# EAGLE board nRF9160 Thing Plus (EAGLE 9.6.2)
REV: C
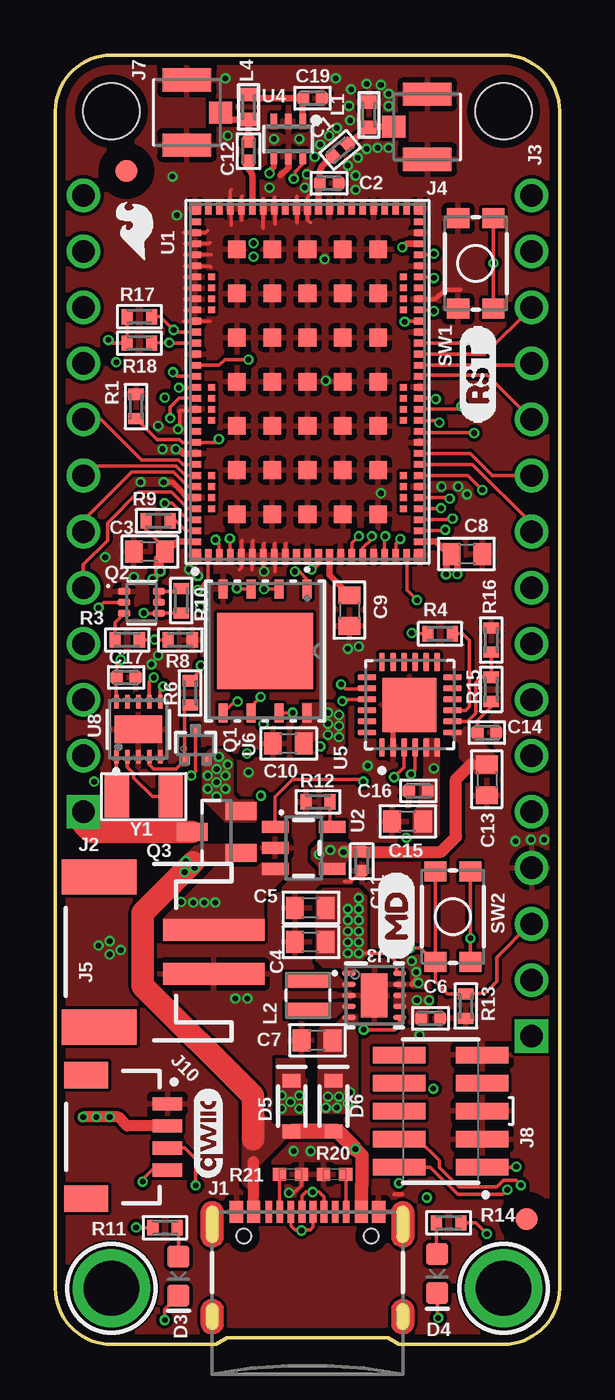
[diagram p3: board, top side]
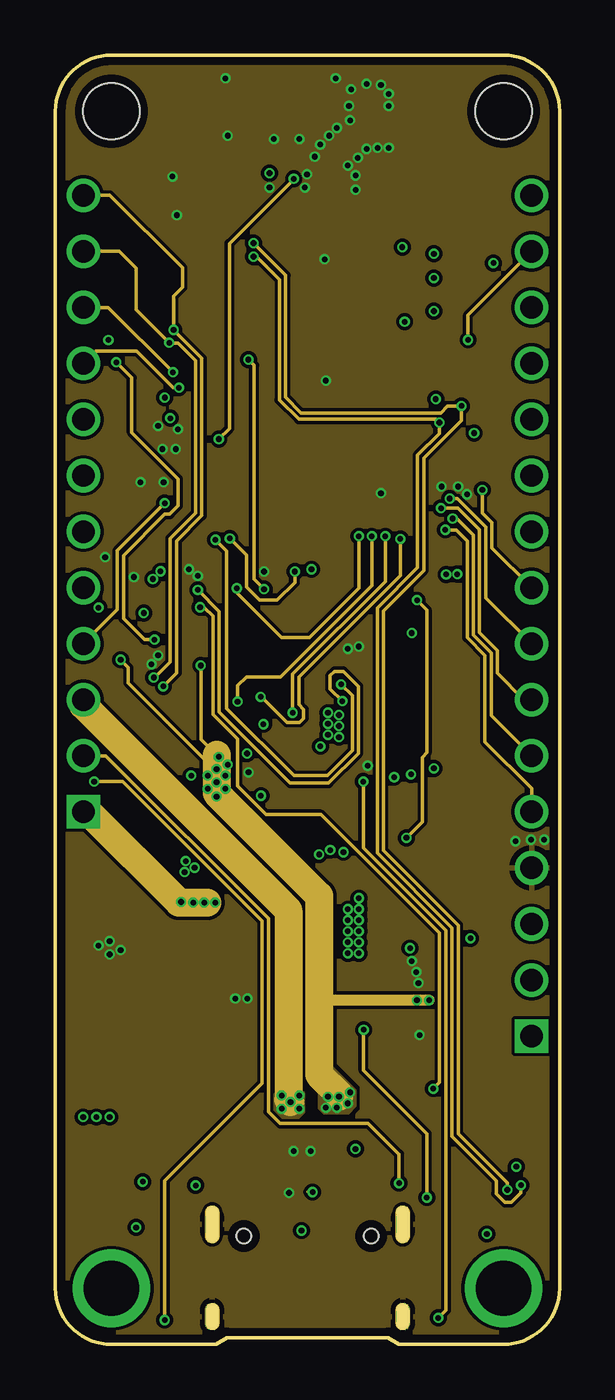
[diagram p4: board, inner layer Route2]
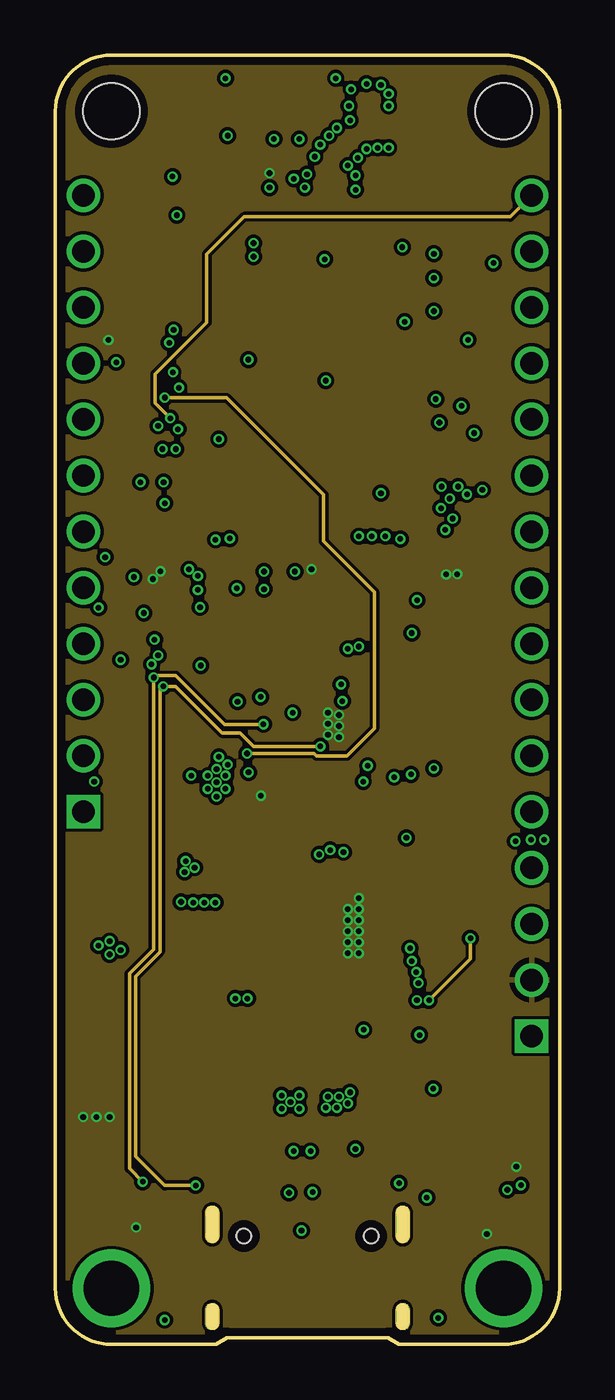
[diagram p5: board, inner layer Route15]
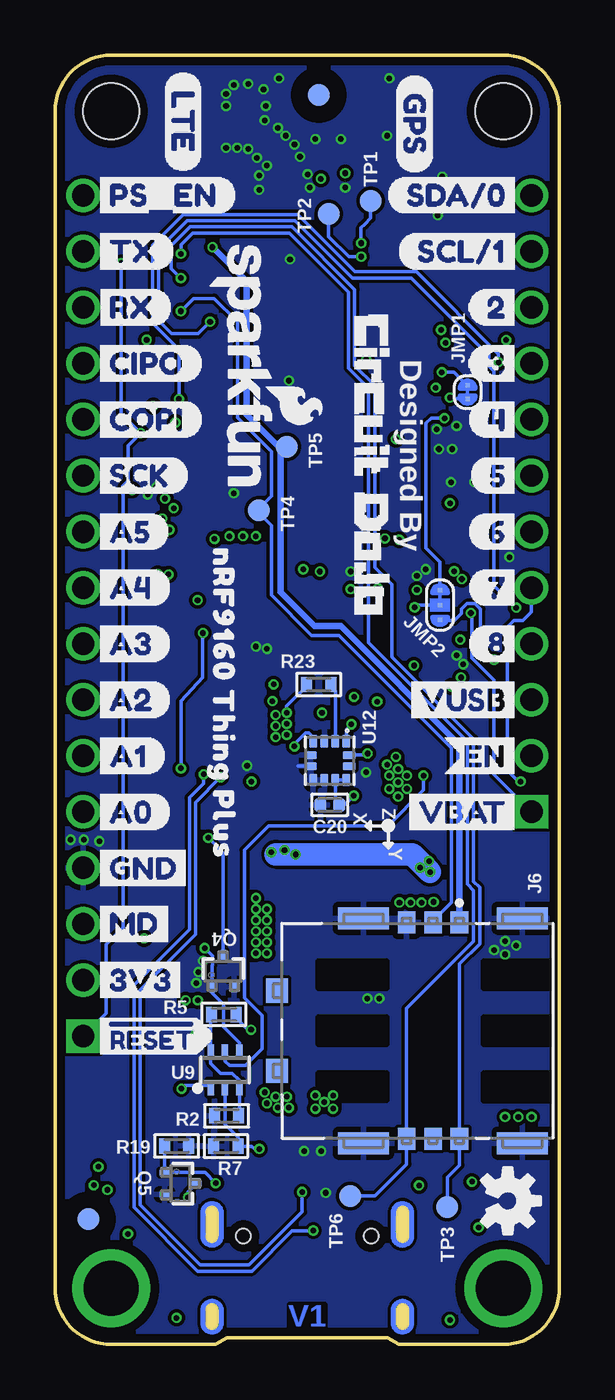
[diagram p6: board, bottom side, seen from below]

Size 22.86 x 58.42 mm. Coordinates in mm from the lower left corner, seen from the top.
Outline: 22.86,2.54 22.86,55.88 arc90 20.32,58.42 2.54,58.42 arc90 0,55.88 0,2.54 arc90 2.54,0 7.28,0 7.79,0.3 15.07,0.3 15.58,0 20.32,0 arc90 22.86,2.54
Copper layers (1*2*15*16): Top 0.035559375mm / dielectric 0.17018125mm / Route2 0.01778125mm / dielectric 47mil / Route15 0.01778125mm / dielectric 0.17018125mm / Bottom 0.035559375mm
Design rules "oshpark-4layer *": minimum track width 5mil, minimum drill 10mil, track to track 5mil, track to pad 5mil, pad to pad 5mil, via to via 5mil, smd to smd 5mil, copper to edge 15mil, drill to drill 6mil, minimum pad ring 4mil, minimum via ring 4mil, stop-mask expansion 2mil, vias tented up to drill 0.3mm, thermal gap 10mil
Net classes: 1 usb: width 0.15 mm; 2 rf: width 0.3 mm
Holes 2.54 mm at 2.54,55.88 20.32,55.88
tRestrict: area 17.4,28.6 to 17.6,29.4; area 15.7,27.5 to 16.5,27.7

## Footprints (pad centres in the part's own frame; a part is rotated, then mirrored left to right if it is on the bottom)
CAPC1005X55N = smd 0.54 x 0.6: 1 -0.43,0; 2 0.43,0
C0603 = smd 0.8 x 1: 1 -0.7,0; 2 0.7,0
LED-0603 = smd 1 x 1: A -0.877,0; C 0.877,0
SOD-323 = smd 0.63 x 0.83: A 1.15,0; C -1.15,0
USB-C-16P_4LAYER-PADS = smd 0.3 x 1: A5 -1.25,-0.34; A6 -0.25,-0.34; A7 0.25,-0.34; A8 1.25,-0.34; B5 1.75,-0.34; B6 0.75,-0.34; B7 -0.75,-0.34; B8 -1.75,-0.34 | smd 0.6 x 1: GND -3.225,-0.34; GND2 3.225,-0.34; VBUS1 -2.45,-0.34; VBUS2 2.45,-0.34 | drill 0.4 pad 0.6 long: SHLD1 -4.318,-0.915; SHLD2 4.318,-0.915; SHLD3 -4.318,-5.095; SHLD4 4.318,-5.095 | hole 0.65: -2.89,-1.445; 2.89,-1.445
CON-HEADER-1X12-MALE-PIN = drill 1.016 square: 1 0,0 | drill 1.016: 2 2.54,0; 3 5.08,0; 4 7.62,0; 5 10.16,0; 6 12.7,0; 7 15.24,0; 8 17.78,0; 9 20.32,0; 10 22.86,0; 11 25.4,0; 12 27.94,0
CON-HEADER-1X16-MALE-PIN = drill 1.016 square: 1 0,0 | drill 1.016: 2 2.54,0; 3 5.08,0; 4 7.62,0; 5 10.16,0; 6 12.7,0; 7 15.24,0; 8 17.78,0; 9 20.32,0; 10 22.86,0; 11 25.4,0; 12 27.94,0; 13 30.48,0; 14 33.02,0; 15 35.56,0; 16 38.1,0
TE_1909763-1 = smd 1 x 1.05: 1 0,-1.525 | smd 1.05 x 2.2: 2 -1.475,0; 3 1.475,0
JST-2-SMD = smd 1 x 4.6: 1 -1,-3.7; 2 1,-3.7 | smd 1.6 x 3.4: NC1 -3.4,1.5; NC2 3.4,1.5
MOLEX_104224-0820 = smd 1 x 2.3: G1 -5.1,1.5; G2 -5.1,8.7; G3 5.1,8.7; G4 5.1,1.5 | smd 1.1 x 1: R1 -1.82,12.625; R2 1.82,12.625 | smd 1 x 0.8: S1 4.9,4.35; S2 4.9,5.55; S3 -4.9,4.35; S4 4.9,6.75; S5 -4.9,5.55; S6 -4.9,6.75
SAMTEC_FTSH-105-XX-X-DV = smd 0.74 x 2.38: 1 -2.54,-1.88; 2 -2.54,1.88; 3 -1.27,-1.88; 4 -1.27,1.88; 5 0,-1.88; 6 0,1.88; 7 1.27,-1.88; 8 1.27,1.88; 9 2.54,-1.88; 10 2.54,1.88
JST04_1MM_RA = smd 0.6 x 1.35: 1 -1.5,0; 2 -0.5,0; 3 0.5,0; 4 1.5,0 | smd 1.2 x 2: NC1 2.8,-3.675; NC2 -2.8,-3.675
JUMPER-ROUND-NC = smd 0.2 x 0.2: P$1 -0.3,0; P$2 0.3,0
JUMPER-ROUND-3-NO-R = smd 0.2 x 0.2: P$1 -0.675,0; P$2 0,0; P$3 0.675,0
IND0402_22N_TAI = smd 0.61 x 0.711: 1 -0.572,0; 2 0.572,0
IND-2P0X2P0X1P2 = smd 0.65 x 2: P$1 -0.675,0; P$2 0.675,0
DIO_RB558WMF-L = smd 0.254 x 0.483: 1 -0.5,-0.711; 2 0.5,-0.711; 3 0,0.711
SOT50P160X60-6N = smd 0.56 x 0.32: 1 -0.785,0.5; 2 -0.785,0; 3 -0.785,-0.5; 4 0.785,-0.5; 5 0.785,0; 6 0.785,0.5
SOT23 = smd 0.8 x 1.4: 1 -0.95,-1.1; 2 0.95,-1.1; 3 0,1.1
R0402-M = smd 0.5 x 0.7: 1 -0.55,0; 2 0.55,0
0402-TIGHT = smd 0.6 x 0.6: 1 -0.5,0; 2 0.5,0
TACTILE_SWITCH_SMD_4.6X2.8MM = smd 0.9 x 1: 1 -2.05,-0.8; 2 2.05,-0.8; 3 2.05,0.8; 4 -2.05,0.8
TP-1P0 = smd 1 x 1: TP 0,0
NORDIC_NRF9160-SICA-R = smd 0.54 x 0.54: 1 -7.845,5.095; 21 -7.845,-5.095; 52 7.845,-5.095; 72 7.845,5.095 | smd 0.54 x 0.3: 2 -7.845,4.5; 3 -7.845,4; 4 -7.845,3.5; 5 -7.845,3; 6 -7.845,2.5; 7 -7.845,2; 8 -7.845,1.5; 9 -7.845,1; 10 -7.845,0.5; 11 -7.845,0; 12 -7.845,-0.5; 13 -7.845,-1; 14 -7.845,-1.5; 15 -7.845,-2; 16 -7.845,-2.5; 17 -7.845,-3; 18 -7.845,-3.5; 19 -7.845,-4; 20 -7.845,-4.5; 53 7.845,-4.5; 54 7.845,-4; 55 7.845,-3.5; 56 7.845,-3; 57 7.845,-2.5; 58 7.845,-2; 59 7.845,-1.5; 60 7.845,-1; 61 7.845,-0.5; 62 7.845,0; 63 7.845,0.5; 64 7.845,1; 65 7.845,1.5; 66 7.845,2; 67 7.845,2.5; 68 7.845,3; 69 7.845,3.5; 70 7.845,4; 71 7.845,4.5 | smd 0.3 x 0.54: 22 -7.25,-5.095; 23 -6.75,-5.095; 24 -6.25,-5.095; 25 -5.75,-5.095; 26 -5.25,-5.095; 27 -4.75,-5.095; 28 -4.25,-5.095; 29 -3.75,-5.095; 30 -3.25,-5.095; 31 -2.75,-5.095; 32 -2.25,-5.095; 33 -1.75,-5.095; 34 -1.25,-5.095; 35 -0.75,-5.095; 36 -0.25,-5.095; 37 0.25,-5.095; 38 0.75,-5.095; 39 1.25,-5.095; 40 1.75,-5.095; 41 2.25,-5.095; 42 2.75,-5.095; 43 3.25,-5.095; 44 3.75,-5.095; 45 4.25,-5.095; 46 4.75,-5.095; 47 5.25,-5.095; 48 5.75,-5.095; 49 6.25,-5.095; 50 6.75,-5.095; 51 7.25,-5.095; 73 7.25,5.095; 74 6.75,5.095; 75 6.25,5.095; 76 5.75,5.095; 77 5.25,5.095; 78 4.75,5.095; 79 4.25,5.095; 80 3.75,5.095; 81 3.25,5.095; 82 2.75,5.095; 83 2.25,5.095; 84 1.75,5.095; 85 1.25,5.095; 86 0.75,5.095; 87 0.25,5.095; 88 -0.25,5.095; 89 -0.75,5.095; 90 -1.25,5.095; 91 -1.75,5.095; 92 -2.25,5.095; 93 -2.75,5.095; 94 -3.25,5.095; 95 -3.75,5.095; 96 -4.25,5.095; 97 -4.75,5.095; 98 -5.25,5.095; 99 -5.75,5.095; 100 -6.25,5.095; 101 -6.75,5.095; 102 -7.25,5.095 | smd 0.8 x 0.8: 103_1 -6,3.2; 103_2 -4,3.2; 103_3 -2,3.2; 103_4 0,3.2; 103_5 2,3.2; 103_6 4,3.2; 103_7 6,3.2; 103_8 -6,1.6; 103_9 -4,1.6; 103_10 -2,1.6; 103_11 0,1.6; 103_12 2,1.6; 103_13 4,1.6; 103_14 6,1.6; 103_15 -6,0; 103_16 -4,0; 103_17 -2,0; 103_18 0,0; 103_19 2,0; 103_20 4,0; 103_21 6,0; 103_22 -6,-1.6; 103_23 -4,-1.6; 103_24 -2,-1.6; 103_25 0,-1.6; 103_26 2,-1.6; 103_27 4,-1.6; 103_28 6,-1.6; 103_29 -6,-3.2; 103_30 -4,-3.2; 103_31 -2,-3.2; 103_32 0,-3.2; 103_33 2,-3.2; 103_34 4,-3.2; 103_35 6,-3.2 | smd 0.3 x 0.3: 104 -5.75,-4.35; 105 -5.25,-4.35; 106 -4.75,-4.35; 107 -4.25,-4.35; 108 -1.75,-4.35; 109 -1.25,-4.35; 110 -0.75,-4.35; 111 -0.25,-4.35; 112 3.25,-4.35; 113 3.75,-4.35; 114 4.25,-4.35; 115 4.75,-4.35; 116 4.75,4.35; 117 4.25,4.35; 118 3.75,4.35; 119 3.25,4.35; 120 -0.25,4.35; 121 -0.75,4.35; 122 -1.25,4.35; 123 -1.75,4.35; 124 -4.25,4.35; 125 -4.75,4.35; 126 -5.25,4.35; 127 -5.75,4.35
SOT23-5 = smd 0.55 x 1.2: 1 -0.95,-1.3; 2 0,-1.3; 3 0.95,-1.3; 4 0.95,1.3; 5 -0.95,1.3
DSK0010A = smd 0.6 x 0.25: 1 -1.15,1; 2 -1.15,0.5; 3 -1.15,0; 4 -1.15,-0.5; 5 -1.15,-1; 6 1.15,-1; 7 1.15,-0.5; 8 1.15,0; 9 1.15,0.5; 10 1.15,1 | smd 1.2 x 2: 11 0,0
SOT363 = smd 0.3 x 0.7: 1 -0.65,-0.8; 2 0,-0.8; 3 0.65,-0.8; 4 0.65,0.8; 5 0,0.8; 6 -0.65,0.8
QFN50P400X400X80-25N = smd 0.84 x 0.26: 1 -1.935,1.25; 2 -1.935,0.75; 3 -1.935,0.25; 4 -1.935,-0.25; 5 -1.935,-0.75; 6 -1.935,-1.25; 13 1.935,-1.25; 14 1.935,-0.75; 15 1.935,-0.25; 16 1.935,0.25; 17 1.935,0.75; 18 1.935,1.25 | smd 0.26 x 0.84: 7 -1.25,-1.935; 8 -0.75,-1.935; 9 -0.25,-1.935; 10 0.25,-1.935; 11 0.75,-1.935; 12 1.25,-1.935; 19 1.25,1.935; 20 0.75,1.935; 21 0.25,1.935; 22 -0.25,1.935; 23 -0.75,1.935; 24 -1.25,1.935 | smd 2.45 x 2.45: 25 0,0
WIN_ZP-8-L = smd 0.86 x 0.403: 1 -2.818,1.905; 2 -2.818,0.635; 3 -2.818,-0.635; 4 -2.818,-1.905; 5 2.818,-1.905; 6 2.818,-0.635; 7 2.818,0.635; 8 2.818,1.905 | smd 3.454 x 4.343: 9 0,0
DFN10_2P7X2P7-L = smd 0.61 x 0.203: 1 -1.245,1; 2 -1.245,0.5; 3 -1.245,0; 4 -1.245,-0.5; 5 -1.245,-1; 6 1.245,-1; 7 1.245,-0.5; 8 1.245,0; 9 1.245,0.5; 10 1.245,1 | smd 1.245 x 2.159: 11 0,0
PQFN50P200X200100-12N = smd 0.575 x 0.35: 1 -0.875,0.75; 2 -0.875,0.25; 3 -0.875,-0.25; 4 -0.875,-0.75; 7 0.875,-0.75; 8 0.875,-0.25; 9 0.875,0.25; 10 0.875,0.75 | smd 0.35 x 0.575: 5 -0.25,-0.875; 6 0.25,-0.875; 11 0.25,0.875; 12 -0.25,0.875
FIDUCIAL-1MM = smd 1 x 1: 1 0,0
MOUNTING-HOLE-2.5MM-PLATED = drill 2.5 pad 3.2: P$1 0,0
XTAL320X150X90 = smd 1.092 x 1.905: 1 -1.219,0; 2 1.219,0

## Placement (x,y rotation side)
C1  15p  [CAPC1005X55N]  12.91,54.12 220 top
C2  15p  [CAPC1005X55N]  12.41,52.62 0 top
C3  4.7u  [C0603]  4.26,35.92 180 top
C4  10u  [C0603]  11.56,18.23 180 top
C5  10u  [C0603]  11.56,19.78 180 top
C6  0.1u  [CAPC1005X55N]  17.01,14.77 0 top
C7  10u  [C0603]  11.86,13.78 180 top
C8  4.7u  [C0603]  18.66,35.82 0 top
C9  4.7u  [C0603]  13.33,33.25 270 top
C10  4.7u  [C0603]  10.56,27.22 180 top
C11  1u  [CAPC1005X55N]  13.89,21.89 270 top
C12  56p  [CAPC1005X55N]  8.76,54.07 90 top
C13  4.7u  [C0603]  19.56,25.58 270 top
C14  0.1u  [CAPC1005X55N]  19.56,27.72 0 top
C15  4.7u  [C0603]  15.96,23.7 180 top
C16  0.1u  [CAPC1005X55N]  16.46,25.08 180 top
C17  0.1u  [CAPC1005X55N]  3.21,30.22 0 top
C19  56p  [CAPC1005X55N]  11.66,56.47 0 top
C20  0.1u  [CAPC1005X55N]  10.41,24.45 180 bottom
D3  BLUE  [LED-0603]  5.58,3.1 270 top
D4  Yellow  [LED-0603]  17.31,3.2 270 top
D5  1A/23V/620mV  [SOD-323]  10.71,10.8 270 top
D6  1A/23V/620mV  [SOD-323]  12.61,10.8 270 top
J1  USB Female C  [USB-C-16P_4LAYER-PADS]  11.43,6.35 0 top
J2  CON-HEADER-1X12-MALE-PIN  [CON-HEADER-1X12-MALE-PIN]  1.27,24.13 90 top
J3  CON-HEADER-1X16-MALE-PIN  [CON-HEADER-1X16-MALE-PIN]  21.59,13.97 90 top
J4  CON-1909763-1  [TE_1909763-1]  16.86,55.17 270 top
J5  [JST-2-SMD]  3.48,17.78 90 top
J6  CON-SIM-104224-0820  [MOLEX_104224-0820]  0.18,14.21 90 bottom
J7  CON-1909763-1  [TE_1909763-1]  5.96,55.82 90 top
J8  CON-FTSH-105-XX-X-DV  [SAMTEC_FTSH-105-XX-X-DV]  17.47,10.57 90 top
J10  QWIIC_RIGHT_ANGLE  [JST04_1MM_RA]  5.08,9.4 270 top
JMP1  JUMPER-NC  [JUMPER-ROUND-NC]  4.16,43.15 90 bottom
JMP2  JUMPER-3/1  [JUMPER-ROUND-3-NO-R]  5.41,33.5 90 bottom
L1  39n  [IND0402_22N_TAI]  14.21,55.72 270 top
L2  1.5u  [IND-2P0X2P0X1P2]  11.46,15.82 90 top
L4  68n  [IND0402_22N_TAI]  8.76,56.07 270 top
LOGO5  OSHW-LOGOS  [OSHW-LOGO-S]  2.35,6.5 270 bottom
PCB1  PCB-NRF91-FEATHER  [PLACEHOLDER]  -12.93,-5.08 0 top  (outside the outline)
Q1  MOSFET-P-SC89  [DIO_RB558WMF-L]  6.36,27.17 0 top
Q2  MOSFET-DUAL-COMP-SOT563  [SOT50P160X60-6N]  3.91,33.62 0 top
Q3  MOSFET-P-20V-4.7A-SOT23  [SOT23]  7.31,23.22 90 top
Q4  MOSFET-N-SC89  [DIO_RB558WMF-L]  15.24,16.91 0 bottom
Q5  MOSFET-N-SC89  [DIO_RB558WMF-L]  17.18,7.29 270 bottom
R1  100k  [R0402-M]  3.66,42.5 270 top
R2  1M  [R0402-M]  15.09,10.36 0 bottom
R3  100k  [R0402-M]  3.26,31.92 180 top
R4  1k  [R0402-M]  17.44,32.2 180 top
R5  100k  [R0402-M]  15.21,14.95 180 bottom
R6  100k  [R0402-M]  6.11,29.52 90 top
R7  100k  [R0402-M]  15.12,8.98 0 bottom
R8  100k  [R0402-M]  5.66,31.92 180 top
R9  1M  [R0402-M]  4.66,37.32 180 top
R10  100k  [R0402-M]  5.71,33.7 270 top
R11  330  [R0402-M]  4.97,5.28 180 top
R12  2k  [R0402-M]  11.91,24.58 0 top
R13  100k  [R0402-M]  18.61,15.33 90 top
R14  330  [R0402-M]  17.83,5.51 0 top
R15  22k  [R0402-M]  19.76,29.68 270 top
R16  33k  [R0402-M]  19.76,31.92 270 top
R17  10k  [R0402-M]  3.81,46.57 180 top
R18  10k  [R0402-M]  3.81,45.37 180 top
R19  1M  [R0402-M]  17.36,8.99 180 bottom
R20  5.1k  [0402-TIGHT]  12.66,7.7 0 top
R21  5.1k  [0402-TIGHT]  10.66,7.7 180 top
R23  100k  [R0402-M]  10.91,29.9 180 bottom
SW1  [TACTILE_SWITCH_SMD_4.6X2.8MM]  19.06,48.98 90 top
SW2  [TACTILE_SWITCH_SMD_4.6X2.8MM]  18.02,19.38 90 top
TP1  TP-1SIDE-1P0  [TP-1P0]  8.56,51.82 270 bottom
TP2  TP-1SIDE-1P0  [TP-1P0]  10.46,51.22 270 bottom
TP3  TP-1SIDE-1P0  [TP-1P0]  5.08,6.23 270 bottom
TP4  TP-1SIDE-1P0  [TP-1P0]  13.62,37.8 270 bottom
TP5  TP-1SIDE-1P0  [TP-1P0]  12.36,40.67 270 bottom
TP6  TP-1SIDE-1P0  [TP-1P0]  9.49,6.72 180 bottom
U1  MOD-NRF9160-SICA-R  [NORDIC_NRF9160-SICA-R]  11.43,43.62 90 top
U2  MCP73831  [SOT23-5]  11.26,22.5 270 top
U3  IC-TPS63031DSKR  [DSK0010A]  14.46,15.82 0 top
U4  POWER-SWITCH-MIC94092YC6  [SOT363]  10.56,54.62 180 top
U5  IC-CP2102N-A02-GQFN24R  [QFN50P400X400X80-25N]  16.06,28.98 90 top
U6  FLASH-WSON  [WIN_ZP-8-L]  9.51,31.42 270 top
U8  IC-PCF85063ATL/1  [DFN10_2P7X2P7-L]  3.76,27.87 90 top
U9  IC-BAV70S  [SOT363]  15.16,12.44 0 bottom
U12  IC-LIS2DH12TR  [PQFN50P200X200100-12N]  10.41,26.45 270 bottom
U$1  [SFE_LOGO_NAME_FLAME_.1]  14.42,44.27 270 bottom
U$2  [LOGO-CIRCUITDOJO]  9.67,46.9 270 bottom
U$3  FIDUCIAL-1MM  [FIDUCIAL-1MM]  10.91,56.62 270 bottom
U$4  FIDUCIAL-1MM  [FIDUCIAL-1MM]  21.36,5.67 270 bottom
U$5  [A3L-LOC]  -164.72,-120.13 0 top  (outside the outline)
U$6  [QWIIC_4MM]  6.94,9.57 90 top
U$7  [RST0]  19.16,41.7 90 top
U$8  [PS_EN0]  21.31,52.07 0 bottom
U$9  [MD0]  15.46,17.4 90 top
U$10  [20]  4.2,46.99 0 bottom
U$11  [30]  4.2,44.45 0 bottom
U$12  [SCL#11]  7.34,49.53 0 bottom
U$13  [SDA#00]  7.82,52.07 0 bottom
U$14  [MD0]  21.31,19.05 0 bottom
U$15  [SFE_LOGO_FLAME_.1]  3.71,50.65 45 top
U$16  [TX0]  21.31,49.53 0 bottom
U$17  [RX0]  21.31,46.99 0 bottom
U$18  [SCK0]  21.31,39.37 0 bottom
U$19  [CIPO0]  21.31,44.45 0 bottom
U$20  [COPI0]  21.31,41.91 0 bottom
U$21  [GPS0]  6.56,57.6 270 bottom
U$22  [LTE0]  17.06,57.7 270 bottom
U$23  [NRF9160_THING_PLUS0]  15.22,29.03 270 bottom
U$24  FIDUCIAL-1MM  [FIDUCIAL-1MM]  21.36,5.67 90 top
U$31  MOUNTING-HOLE-2.5MM-PLATED  [MOUNTING-HOLE-2.5MM-PLATED]  2.54,2.54 0 top
U$32  MOUNTING-HOLE-2.5MM-PLATED  [MOUNTING-HOLE-2.5MM-PLATED]  20.32,2.54 0 top
U$35  FIDUCIAL-1MM  [FIDUCIAL-1MM]  3.23,53.17 0 top
U$69  [GND12]  21.31,21.59 0 bottom
U$71  [3V314]  21.35,16.51 0 bottom
U$72  [#RESET15]  21.46,13.97 0 bottom
U$73  [VUSB25]  7.23,29.21 0 bottom
U$74  [EN26]  5.28,26.67 0 bottom
U$75  [VBAT27]  7.28,24.13 0 bottom
U$83  [A56]  21.31,36.83 0 bottom
U$84  [A47]  21.3,34.29 0 bottom
U$85  [A38]  21.34,31.75 0 bottom
U$86  [A29]  21.35,29.21 0 bottom
U$87  [A110]  21.3,26.67 0 bottom
U$88  [A011]  21.35,24.13 0 bottom
U$89  [412]  4.2,41.91 0 bottom
U$90  [513]  4.11,39.37 0 bottom
U$91  [614]  4.16,36.83 0 bottom
U$92  [715]  4.16,34.29 0 bottom
U$93  [816]  4.15,31.75 0 bottom
Y1  XTAL-ABS07AIG-32.768KHZ-7-T  [XTAL320X150X90]  4.01,24.82 180 top

## Tracks (layer width: path | path; a pad name or v marks a point on that pad's centre or on a via)
!EN  (via drill 0.25)
  Route2 0.152: J2.2 2.29,26.67 9.66,19.3 9.66,10.54 10.19,10.01 14.18,10.01 15.58,8.61 v15.58,7.3
  Bottom 0.152: R19.2 17.91,7.8 Q5.1 16.07,7.79 v15.58,7.3
!RESET  (via drill 0.25)
  Top 0.152: U1.32 16.48,41.32 18.96,41.32 v18.98,41.3 | SW1.1 v19.86,49 SW1.2
  Bottom 0.152: J3.1 20.55,15.01 20.55,18.13 19.78,18.9 19.78,38.53 19.79,38.54 19.79,38.9 19.55,39.14 19.55,40.73 v18.98,41.3 19.86,42.17 19.86,48.98 v19.86,48.99 v19.86,49
+3V3  (via drill 0.25)
  Top 0.152: C3.1 5.01,36.02 4.11,36.92 R9.2 | 4.27,5.43 R11.2 3.68,5.28 v3.66,5.3 | U1.12 11.93,35.34 11.71,35.12 v11.61,35.12 | R17.2 R18.2 2.55,45.37 v2.41,45.51 | R14.2 19.05,5.51 v19.56,5 | U3.10 15.46,16.97 15.46,17.3 15.04,17.72 v13.76,17.72 | J8.1 20.88,8.03 v20.9,8.05
  Top 0.203: C8.1 17.79,35.84
  Top 0.254: v9.71,53.07 9.71,53.17 9.91,53.37 U4.4
  Top 0.305: U1.102 5.56,36.37 C3.1 4.77,35.41 v4.77,35.03 | v4.42,34.68 4.61,34.87 4.61,35.62 5.01,36.02 | v17.72,34.89 17.72,35.58 C8.1 18.22,35.56 v18.22,34.9 | U1.22 17.26,36.37 17.79,35.84
  Top 0.508: J10.2 3.26,9.9 2.86,10.3 v2.46,10.3 v1.86,10.3 v1.26,10.3
  Bottom 0.152: U12.10 U12.9 10.16,24.63 C20.1 9.73,24.45 v9.32,24.86 | v12.36,28.62 12.36,28.92 11.46,29.82 R23.2
  other vias: 13.76,18.72 13.76,18.22 13.26,18.72 13.26,19.22 13.76,19.22 13.76,19.72 13.26,19.72 13.76,20.22 12.36,27.62 12.36,28.12 12.86,28.52 12.86,28.02 12.86,27.52 13.26,18.22 13.26,17.72
  pour Top (no thermals): 13.56,17.12 13.56,16.82 13.06,16.82 13.06,17.02 12.96,17.12 12.16,17.12 11.86,17.42 11.86,20.32 12.16,20.62 13.74,20.62 14.06,20.3 14.06,17.62
  pour Route15 (isolate 0.152, rank 2): 22.86,58.42 22.86,0 0,0 0,58.42
  pour Top (no thermals): 10.96,26.82 12.66,26.82 13.06,27.22 13.06,28.52 12.56,29.02 11.26,29.02 11.26,28.12 10.96,27.82
ANT
  Top 0.3: U1.61 11.93,52.57 C2.1 11.98,53.02 arc-49 12.2,53.5 arc3 C1.2
ANT_FILT
  Top 0.3: C1.1 14.11,55.05 L1.2 14.21,55.17 J4.1
CHRG  (via drill 0.25)
  Top 0.152: U2.1 9.96,24.8 10.76,25.6 13.86,25.6 v13.96,25.5 | v17.36,1.2 17.31,1.25 D4.C
  Route2 0.152: v13.96,25.5 13.96,22.5 17.71,18.75 17.71,1.55 v17.36,1.2 17.57,1.41
COEX0/LNA_EN  (via drill 0.25)
  Top 0.152: v7.41,41.02 7.41,40.87 U1.93 5.77,40.87 5.64,41 4.61,41 R1.2 | U4.6 11.21,53.47 10.86,53.12 10.86,52.82 v10.81,52.82
  Route2 0.152: v7.41,41.02 7.89,41.5 7.89,49.88 10.81,52.8 v10.81,52.82
CP212_VBUS
  Top 0.152: U5.8 18.69,28.23 19.06,28.6 19.06,30 19.29,30.23 R15.1 R16.2
CP2102N-!RST
  Top 0.152: R4.1 18.46,32.2 18.76,31.9 18.76,28.9 18.59,28.73 U5.9
CP2102N-VDD  (via drill 0.25)
  Top 0.152: R4.2 16.16,32.2 v16.16,32.23
  Bottom 0.152: v17.16,26.1 17.16,29.15 16.17,30.21 v16.17,32.22 v16.16,32.23
  pour Top (no thermals): 16.76,27.4 16.76,25.6 16.56,25.4 16.56,24.4 16.26,24.1 16.26,23.1 17.36,23.1 17.36,27.4
DIFF_N  (via drill 0.25)
  Top 0.152: J1.B7 10.68,5.38 10.86,5.2 11.16,5.2 | 11.16,5.2 11.56,5.2 11.68,5.32 J1.A7 | 11.16,5.2 v11.16,5.15 | U5.4 16.31,26.01 v16.12,25.83
  Bottom 0.152: v16.12,25.83 16.12,25.43 16.77,24.78 16.77,18.8 19.29,16.29 19.29,6.21 16.4,3.32 13.94,3.32 12.11,5.15 v11.16,5.15
DIFF_P  (via drill 0.25)
  Top 0.152: J1.A6 11.18,6.72 11.36,6.9 v11.66,6.9 11.96,6.9 12.18,6.68 J1.B6 | U5.3 15.81,26.15 v15.36,25.7
  Route2 0.152: v11.66,6.9 11.46,6.9
  Bottom 0.152: v15.36,25.7 16.5,24.57 16.5,18.59 19.01,16.07 19.01,6.33 16.28,3.6 14.06,3.6 11.66,6 v11.66,6.9
FLASH_CS  (via drill 0.25)
  Top 0.152: U1.4 7.93,36.5 v7.91,36.52 | v10.86,35.02 11.06,35.02 11.41,34.66 U6.1
  Route2 0.152: v7.91,36.52 8.66,35.77 8.66,34.32 9.26,33.72 10.06,33.72 10.86,34.52 v10.86,35.02
FLASH_HOLD  (via drill 0.25)
  Top 0.152: U1.18 14.93,36.59 v14.96,36.62 | U6.7 10.74,28.6 v10.76,28.62
  Route2 0.152: v14.96,36.62 14.96,34.57 10.76,30.37 v10.76,28.62
FLASH_SCK  (via drill 0.25)
  Top 0.152: v15.64,36.5 15.43,36.29 U1.19 | U6.6 8.88,28.9 v9.31,29.34
  Route2 0.152: v9.31,29.34 9.34,29.34 10.49,28.19 11.08,28.19 11.26,28.37 11.26,28.77 11.04,28.99 11.04,30.25 15.64,34.85 v15.64,36.5
FLASH_SI  (via drill 0.25)
  Top 0.152: U6.5 8.13,29.13 v8.26,29.13 | v14.34,36.62 14.34,36.49 13.93,36.08 U1.16
  Route2 0.152: v8.26,29.13 8.26,29.85 8.66,30.25 10.21,30.25 14.34,34.38 v14.34,36.62
FLASH_SO  (via drill 0.25)
  Top 0.152: U1.86 7.43,44.37 7.68,44.62 v8.76,44.62 | U6.2 9.48,34.24 v9.46,34.22
  Route2 0.152: v9.46,34.22 9.01,34.67 9.01,44.37 v8.76,44.62
FLASH_WP  (via drill 0.25)
  Top 0.152: U1.15 13.45,35.89 13.45,36.31 v13.76,36.62 | v8.23,34.26 8.25,34.24 U6.3
  Route2 0.152: v8.23,34.26 8.23,34.06 10.24,32.04 11.53,32.04 13.76,34.27 v13.76,36.62
GND  (via drill 0.25)
  Top 0.152: 5.81,46.37 U1.82 7.01,46.37 | 5.81,50.37 U1.74 6.81,50.37 6.91,50.47 | 6.48,46.87 5.86,46.87 | 6.48,47.37 5.86,47.37 | 6.48,47.87 5.86,47.87 | 6.48,48.37 U1.78 5.86,48.37 | 6.48,48.87 5.86,48.87 | 6.48,49.37 5.86,49.37 | 6.48,49.87 5.86,49.87 | 9.41,50.57 9.41,51.35 U1.66 9.41,51.39 9.41,51.92 | 9.96,50.77 9.96,51.34 U1.65 9.93,51.99 | 10.96,50.82 10.96,51.34 U1.63 10.93,51.99 10.96,52.02 | 11.56,50.82 11.43,50.95 U1.62 11.43,51.99 11.51,52.07 | U1.77 7.01,48.87 7.06,48.82 | U1.76 7.06,49.37 | U1.75 6.96,49.87 7.01,49.92 | U1.90 6.29,42.32 5.66,42.32 5.64,42.3 5.64,41.54 v5.57,41.47 v5.56,41.47 | 7.96,50.72 7.96,51.44 U1.69 7.93,52.29 7.96,52.32 | 8.46,52.02 8.43,51.99 U1.68 8.43,50.95 | 8.46,36.42 8.43,36.39 U1.5 8.43,35.19 8.36,35.12 | U1.6 8.93,36.39 8.96,36.42 | 9.46,36.32 9.43,36.29 U1.7 9.43,35.64 9.41,35.62 | 9.96,36.32 9.93,36.29 U1.8 9.96,35.74 9.96,35.02 | U1.9 10.43,36.29 10.46,36.32 | 8.91,35.72 8.91,35.12 | 9.41,35.72 9.41,35.62 | 9.41,35.62 9.41,35.12 | R21.1 11.16,7.2 10.83,6.87 v10.59,6.87 | C11.2 13.41,20.98 13.11,20.98
  Top 0.2: J1.GND2 15.66,6.01 15.75,5.92 J1.SHLD2 | 15.72,6.79 15.37,6.79
  Top 0.203: 16.06,28.7 U5.25 | 18.36,47.8 17.69,47.8 17.46,47.56 17.43,47.56 17.23,47.37 U1.44
  Top 0.254: 16.16,16.32 16.36,16.52 | 5.87,38.51 5.31,39.07 v4.91,39.07 | U5.2 15.31,27.95 16.06,28.7
  Top 0.3: 9.71,52.47 v9.71,52.42 | 10.22,52.98 10.56,53.32 U4.5
  Top 0.305: U1.98 6.01,38.37 5.87,38.51 | U1.94 5.8,40.37 5.69,40.48 5.55,40.48 v5.46,40.57
  Bottom 0.152: U12.6 11.86,26.2
  other vias: 3.86,39.07 2.26,35.67 3.56,34.77 6.46,34.82 6.06,35.12 8.16,15.67 8.71,15.67 17.51,38.87 18.26,38.87 18.66,38.52 13.26,53.42 13.61,52.97 13.71,53.77 15.11,56.12 5.31,52.92 5.51,51.17 15.11,54.22 14.11,54.17 4.86,40.57 4.66,41.62 9.91,54.62 11.06,54.62 13.61,52.32 15.11,56.67 13.31,56.12 13.41,56.87 14.11,57.12 14.76,57.07 13.36,55.47 12.76,55.12 12.41,54.77 12.01,54.37 11.76,53.82 11.41,53.02 11.31,52.42 12.71,57.37 14.61,54.22 7.71,57.37 7.81,54.77 9.46,35.02 14.76,38.57 21.56,22.87 20.86,22.8 22.16,22.87 2.46,18.27 1.96,18.07 2.96,17.87 2.46,17.67 16.46,16.37 16.36,16.87 16.16,17.37 16.51,14.02 12.26,43.67 12.21,49.17 4.66,31.22 4.36,30.82 13.26,31.52 13.76,31.62 8.76,25.92 14.16,26.22 10.8,8.76 11.57,8.76
  pour Top (isolate 0.152, rank 2): 0,0 22.86,0 22.86,58.42 0,58.42
  pour Bottom (isolate 0.152, rank 2): 22.86,58.42 22.86,0 0,0 0,58.42
  pour Route2 (isolate 0.152, rank 2): 0,0 22.86,0 22.86,58.42 0,58.42
GPS
  Top 0.3: C12.1 8.76,53.37 arc39 8.83,53.17 arc-49 8.93,52.77 U1.67
GPS_ANT
  Top 0.3: J7.1 7.81,55.5 L4.2 C12.2
LNA_SW_OUT
  Top 0.254: 8.85,56.73 8.87,56.73
  Top 0.3: U4.1 11.21,56.45 C19.1 9.13,56.47 8.87,56.73 | L4.1 8.85,56.73
MODE/WAKE  (via drill 0.25)
  Top 0.152: SW2.3 SW2.4 17.22,17.29 | 17.22,17.29 17.22,16.44 17.78,15.88 R13.2 18.46,15.91 19.47,15.91 | J3.3 21.52,19.05 20.01,17.54 20.01,16.45 19.47,15.91 | 19.46,15.9 19.47,15.91 | v16.08,17.95 16.56,17.95 17.22,17.29
  Bottom 0.152: U9.4 14.51,13.66 15.23,14.38 15.23,15.41 15.74,15.92 Q4.1 15.74,17.18 15.73,17.19 15.73,17.6 v16.08,17.95
N$1
  pour Top (no thermals): 13.16,15.42 10.51,15.42 10.51,14.87 12.71,14.87 13.16,15.32
N$2
  pour Top (no thermals): 13.16,16.32 12.71,16.77 10.51,16.77 10.51,16.22 13.06,16.22
N$3
  Top 0.152: J1.A5 10.16,6.03 R21.2
N$4
  Top 0.152: R9.1 5.46,37.32 5.91,36.87 U1.101
N$5
  Top 0.305: U1.13 12.43,34.85 C9.1
N$6
  Top 0.152: R3.2 2.71,32.7 Q2.3
N$7
  Top 0.152: Q2.5 Q2.6 5.58,34.12 R10.1
N$8
  Top 0.152: R11.1 5.58,5.22 D3.A
N$9
  Top 0.152: J1.B5 13.18,7.68 R20.2
N$10
  Top 0.152: U8.1 2.76,24.85 Y1.2
N$11
  Bottom 0.152: U12.2 10.16,29.6 10.36,29.8 R23.1
N$12  (via drill 0.25)
  Route15 0.152: v4.96,42.9 7.76,42.9 12.16,38.5 12.16,36.4 14.46,34.1 14.46,27.9 13.23,26.67 11.84,26.67 11.73,26.78 v8.69,26.78
  Bottom 0.152: U12.12 8.77,26.7 v8.69,26.78 | JMP1.P$1 4.91,42.85 v4.96,42.9
N$13
  Top 0.152: D4.A 17.28,4.11 R14.1
N$18
  Top 0.152: Y1.1 4.41,24.82 3.56,25.67 3.56,25.87 3.26,26.17 U8.2
NRF_PS_EN_JMP  (via drill 0.25)
  Route2 0.152: 7.15,33 7.15,28.53 8.26,27.43 8.26,25.3 9.55,24.01 12.05,24.01 17.42,18.64 17.42,11.87 v17.14,11.59 | 7.15,33 7.15,33.01 | 7.15,33 6.75,33.4 v6.56,33.4
  Bottom 0.152: JMP2.P$2 6.46,33.5 v6.56,33.4 | U9.1 15.91,11.74 16.98,11.74 v17.14,11.59
P0.00/D4
  Top 0.152: J2.8 2.07,41.91 3.9,40.08 5.59,40.08 5.8,39.87 U1.95
P0.01/D5
  Top 0.152: U1.96 5.91,39.37 5.48,39.8 1.7,39.8 J2.7
P0.02/D6
  Top 0.152: U1.97 6.01,38.87 5.36,39.52 3.46,39.52 1.27,37.33 J2.6
P0.03/D7  (via drill 0.25)
  Top 0.152: U1.99 6.01,37.87 5.26,38.62 3.76,38.62 2.36,37.22 2.36,36.42 1.27,35.33 J2.5 | D3.C 4.96,1.6 v4.96,1.1
  Route2 0.152: v4.96,1.1 4.96,7.4 9.38,11.82 9.38,19.18 3.06,25.5 v1.76,25.5
  Bottom 0.152: v1.76,25.5 1.86,25.5 2.36,26 2.36,32.5 2.06,32.8 1.66,32.8 1.27,33.19 J2.5
P0.04/D8  (via drill 0.25)
  Top 0.152: U1.100 6.01,37.37 5.66,37.72 5.66,37.75 5.3,38.12 v4.96,38.12
  Route2 0.152: v4.96,38.12 2.81,35.97 2.81,33.29 J2.4
P0.05/USB_UART_RX  (via drill 0.25)
  Top 0.152: U1.2 6.93,34.66 v6.46,34.19 | U5.21 13.09,29.23 v13.01,29.15
  Route2 0.152: v6.46,34.19 7.43,33.22 7.43,28.65 10.64,25.44 12.39,25.44 13.74,26.78 13.74,29.82 13.06,30.5 12.66,30.5 12.46,30.3 12.46,29.7 v13.01,29.15
P0.06/USB_UART_TX  (via drill 0.25)
  Top 0.152: U5.20 14.1,29.7 13.16,29.7 v12.96,29.91 | U1.3 7.43,36.29 v7.26,36.46
  Route2 0.152: v7.26,36.46 7.76,35.96 7.76,28.82 10.81,25.77 12.33,25.77 13.46,26.9 13.46,29.4 v12.96,29.91
P0.12/MD  (via drill 0.25)
  Top 0.152: U1.20 15.93,34.19 v16.4,33.72
  Route2 0.152: v16.4,33.72 16.84,33.28 16.84,26.81 16.63,26.6 16.63,23.67 v15.91,22.95
  Bottom 0.152: Q4.3 15.24,22.28 v15.91,22.95
P0.13/A0  (via drill 0.25)
  Top 0.152: U1.23 17.64,36.87 v17.68,36.91
  Route2 0.152: v17.68,36.91 18.17,36.91 18.67,36.41 18.67,32.02 19.48,31.21 19.48,27.3 21.59,25.19 J3.5
P0.14/A1  (via drill 0.25)
  Top 0.152: U1.24 17.96,37.37 v18.01,37.42
  Route2 0.152: J3.6 19.76,28.5 19.76,31.33 18.95,32.14 18.95,36.68 18.21,37.42 v18.01,37.42
P0.15/A2  (via drill 0.25)
  Top 0.152: U1.25 17.51,37.87 v17.48,37.89
  Route2 0.152: v17.48,37.89 18.26,37.89 19.23,36.92 19.23,32.25 20.04,31.45 20.04,30.42 21.25,29.21 J3.7
P0.16/A3  (via drill 0.25)
  Top 0.152: v17.88,38.33 17.83,38.37 U1.26
  Route2 0.152: v17.88,38.33 18.23,38.33 19.51,37.04 19.51,33.83 J3.8
P0.17/A4  (via drill 0.25)
  Top 0.152: U1.28 18.71,39.37 v19.36,38.72
  Route2 0.152: J3.9 19.8,36.08 19.8,37.23 19.36,37.67 v19.36,38.72
P0.18/A5
  Top 0.152: U1.29 18.91,39.87 21.59,37.19 J3.10
P0.19/SCK
  Top 0.152: U1.30 18.81,40.37 19.81,39.37 J3.11
P0.20/VBAT_MEAS  (via drill 0.25)
  Top 0.152: R8.2 R3.1 4.48,31.92 v4.5,31.93 | U1.35 17.21,42.87 v17.25,42.83
  Route2 0.152: v4.5,31.93 4.05,31.93 3.09,32.89 3.09,35.75 4.96,37.62 5.18,37.62 5.56,38 5.56,39.22 3.46,41.32 3.46,43.8 v2.76,44.5
  Bottom 0.152: v2.76,44.5 2.76,44.87 6.49,48.6 9.26,48.6 11.86,51.2 17.07,51.2 18.45,49.82 18.45,46.27 17.25,45.07 v17.25,42.83
P0.21/COPI
  Top 0.152: U1.37 16.48,43.92 19.58,43.92 J3.12
P0.22/CIPO
  Top 0.152: U1.38 21.51,44.37 J3.13
P0.23/RX
  Top 0.152: U1.39 19.47,44.87 J3.14
P0.24/TX  (via drill 0.25)
  Top 0.152: v18.71,45.52 18.56,45.37 U1.40
  Route2 0.152: v18.71,45.52 18.71,46.65 J3.15
P0.25/VBAT_MEAS_EN  (via drill 0.25)
  Top 0.152: U1.42 15.91,46.37 15.86,46.32 15.85,46.32 v15.84,46.34 | Q2.2 2.19,33.62 v1.96,33.39
  Bottom 0.152: v1.96,33.39 2.96,34.39 2.96,44.09 3.19,44.32 3.19,44.8 | 3.19,44.8 3.19,44.91 | 3.19,44.8 6.71,48.32 9.38,48.32 11.97,50.92 16.88,50.92 18.17,49.63 18.17,46.39 17.58,45.8 16.37,45.8 v15.84,46.34
P0.26/SDA  (via drill 0.25)
  Top 0.152: U1.83 5.36,45.87 v5.36,45.97 4.76,46.57 R17.1 4.51,46.57 | v4.89,29.82 4.76,29.68 U8.6 | J10.3 5.86,8.9 6.36,8.4 v6.36,7.2
  Route2 0.152: J2.12 2.47,52.07 5.76,48.78 5.76,47.9 5.36,47.5 v5.36,45.97 6.64,44.69 6.64,37.55 5.5,36.41 5.5,30.42 v4.89,29.82
  Route15 0.152: v6.36,7.2 4.96,7.2 3.64,8.52 3.64,16.68 4.74,17.78 4.74,29.66 v4.89,29.82 5.45,29.82 7.55,27.71 8.37,27.71 8.98,27.1 v12.02,27.1
  Bottom 0.152: U12.4 11.16,27.5 11.36,27.7 11.52,27.7 12.02,27.2 v12.02,27.1
P0.27/SCL  (via drill 0.25)
  Top 0.152: U1.84 5.18,45.37 v5.16,45.39 5.14,45.39 R18.1 | U8.7 4.26,30.02 v4.46,30.22 | v3.96,7.37 3.96,7.47 4.39,7.9 J10.4
  Route2 0.152: v4.46,30.22 4.51,30.22 5.21,30.92 5.21,36.52 6.36,37.67 6.36,44.58 5.57,45.37 5.16,45.37 v5.16,45.39 3.66,46.89 3.66,48.76 2.89,49.53 J2.11
  Route15 0.152: v3.96,7.37 3.36,7.97 3.36,16.8 4.46,17.9 v4.46,30.22 4.54,30.3 5.46,30.3 7.66,28.1 v9.43,28.1
  Bottom 0.152: v9.43,28.1 9.66,27.87 U12.1
P0.29/D2  (via drill 0.25)
  Top 0.152: v5.33,44.05 5.51,43.87 U1.87
  Route2 0.152: J2.10 2.39,46.99 v5.33,44.05
  Bottom 0.152: v5.33,44.05 4.78,44.05 4.18,43.45 JMP1.P$2
P0.30/D3  (via drill 0.25)
  Top 0.152: v5.6,43.35 6.32,43.35 U1.88
  Route2 0.152: v5.6,43.35 5.33,43.35 3.68,45 1.82,45 J2.9
P0.31/NRF_PS_EN  (via drill 0.25)
  Top 0.152: v5.21,41.97 5.21,42.47 5.61,42.87 U1.89
  Route15 0.152: J3.16 20.62,51.1 8.56,51.1 6.86,49.4 6.86,46.3 4.53,43.97 4.53,42.65 v5.21,41.97
  Bottom 0.152: v5.21,41.97 5.81,41.97 6.04,41.74 6.04,36.08 5.41,35.45 JMP2.P$3
PROG
  Top 0.152: U2.5 12.46,23.55 R12.2
PS_EN  (via drill 0.25)
  Top 0.152: U3.6 15.61,14.47 15.39,14.25 v13.98,14.25
  Route2 0.152: v13.98,14.25 13.98,12.41 16.84,9.54 v16.84,6.65
  Bottom 0.152: R5.1 14.66,14.8 14.12,14.25 v13.98,14.25 | Q5.3 16.84,6.92 v16.84,6.65
PS_EN_CC
  Bottom 0.152: 15.81,13.07 15.81,12.74 15.36,12.29 14.84,12.29 14.51,11.96 U9.3 14.51,10.38 | U9.6 15.81,14.9 R5.2
  Bottom 0.2: R2.2 14.51,10.38 | U9.3 14.57,11.71 14.57,11.83 | 15.81,13.07 U9.6
RTC_INT
  Top 0.152: U8.4 4.26,26.27 4.45,26.08 5.48,26.08 Q1.1 5.86,28.72 R6.1
RTC_PS_EN  (via drill 0.25)
  Top 0.152: Q1.3 6.36,25.97 v6.16,25.77
  Bottom 0.152: v6.16,25.77 6.16,25.12 7.78,23.5 13.18,23.5 14.28,22.4 14.28,15.71 13.48,14.91 13.48,13.38 14.23,12.63 14.96,12.63 15.16,12.83 U9.5
SIM_CLK  (via drill 0.25)
  Top 0.152: U1.46 17.16,48.37 v17.16,48.32
  Bottom 0.152: v17.16,48.32 v17.17,48.32 17.59,48.74 17.59,49.79 16.74,50.64 12.12,50.64 9.28,47.8 9.28,44.36 8.37,43.45 8.37,35.21 7.6,34.44 7.6,31.14 3.9,27.43 3.9,20.98 3.61,20.7 3.61,18.15 4.53,17.23 J6.S3 4.53,8.12 5.08,7.57 TP3.TP
SIM_IO  (via drill 0.25)
  Top 0.152: U1.48 17.11,49.37 v17.16,49.42
  Bottom 0.152: v17.16,49.42 17.16,49.83 16.62,50.36 12.23,50.36 9.56,47.69 9.56,44.24 8.65,43.33 8.65,34.45 8.66,34.44 8.66,31.8 4.17,27.32 4.17,20.86 3.89,20.58 3.89,18.27 6.93,15.23 J6.S6 6.93,8.16 8.37,6.72 TP6.TP
SIM_RST  (via drill 0.25)
  Top 0.152: v17.16,46.82 17.11,46.87 U1.43
  Bottom 0.152: v17.16,46.82 16.59,47.39 15.65,47.39 14.6,46.34 14.6,42 13.06,40.46 13.06,38.43 13.52,37.98 13.52,37.91 TP4.TP 13.69,37.73 13.06,37.1 13.06,33.95 11.24,32.13 9.99,32.13 4.89,27.02 4.89,20.02 5.73,19.18 J6.S2
SIM_VCC  (via drill 0.25)
  Top 0.152: v15.73,49.72 15.78,49.72
  Top 0.305: U1.49 15.93,49.87 15.78,49.72
  Bottom 0.305: J6.S1 4.53,27.17 9.91,32.55 11.1,32.55 12.64,34.09 12.64,40.39 TP5.TP 12.71,40.67 14.18,42.14 14.18,48.17 v15.73,49.72
SWCLK  (via drill 0.25)
  Top 0.152: 17.33,41.87 U1.33 | 17.33,41.87 17.41,41.79 v17.41,41.77 17.33,41.85 17.33,41.87 | J8.4 16.43,9.3 17.4,8.33 17.4,8.03 18.29,7.14 20.02,7.14 20.31,7.43 20.89,7.43 v21.11,7.21
  Route2 0.152: v9,49.3 v8.99,49.29 9.13,49.29 10.16,48.26 10.16,42.8 11.04,41.92 17.26,41.92 v17.41,41.77 17.41,41.28 16.42,40.29 16.42,35.19 14.59,33.36 14.59,22.27 17.99,18.87 17.99,9.42 19.99,7.42 19.99,6.82 20.38,6.43 20.67,6.43 21.11,6.87 v21.11,7.21
  Bottom 0.152: v8.99,49.29 9.55,49.29 10.46,50.2 TP2.TP
SWDIO  (via drill 0.25)
  Top 0.152: U1.34 18.26,42.37 v18.41,42.52 | J8.2 17,8.03 18.24,6.79 20.28,6.79 v20.49,7
  Route2 0.152: v8.99,49.9 10.44,48.45 10.44,42.92 11.14,42.21 17.47,42.21 17.78,42.52 v18.41,42.52 v18.4,42.51 18.4,41.87 16.7,40.17 16.7,35.07 14.87,33.24 14.87,22.38 18.27,18.99 18.27,9.55 20.49,7.32 v20.49,7
  Bottom 0.15: TP1.TP 8.56,51.03 8.81,50.77
  Bottom 0.152: v8.99,49.9 8.99,50.6 8.81,50.77
VBAT  (via drill 0.25)
  Top 0.152: v4.01,33.14 4.03,33.12 Q2.4 4.72,33.15 R10.2
  Top 1.016: Q3.3 1.63,23.22 1.27,23.58 J2.1
  Route2 0.61: v6.75,20.02 5.6,20.02
  Route2 1.27: 6.9,20.02 5.6,20.02 1.49,24.13 J2.1
  Bottom 0.152: v4.01,33.14 3.96,33.09 3.96,31.1 2.96,30.1 2.96,25.82 J2.1
  other vias: 5.7,20.05 6.25,20.02 7.25,20.02
  pour Top (no thermals): 4.97,18.39 9.39,18.39 9.39,20.22 10.49,21.32 10.49,21.76 9.34,21.76 9.14,21.56 7.24,21.56 4.97,19.29
  pour Route2 (no thermals): 6.42,19.66 7.25,19.85 6.42,20.15
VBUS  (via drill 0.25)
  Top 0.152: 13.08,22.32 v13.06,22.3 | v5.91,21.9 5.91,21.45 v5.86,21.4 | R15.2 19.76,28.9 19.13,28.27 C14.1 | D6.A 12.81,9.65
  Top 0.406: 8.56,22.27 Q3.1 | 18.84,26.28 C13.1
  Top 0.508: J1.VBUS1 8.98,8.28
  Top 0.55: 18.84,26.28 18.16,25.6 18.16,23 17.48,22.32 C11.1 13.08,22.32
  Top 0.61: J1.VBUS2 13.88,7.21 13.89,7.22 13.89,8.18 13.89,8.57 v13.61,8.86 | D6.A D5.A
  Top 0.68: D5.A 12.81,9.65 v13.61,8.86
  Top 1.016: 8.96,9.3 8.96,11.25 3.96,16.25 3.96,19.55 6.24,21.83
  Bottom 0.152: v13.06,22.3 12.96,22.3 12.86,22.2 | v13.61,8.86 13.82,8.86 13.95,8.98 R7.2 14.57,9.38 15.16,9.97 U9.2
  Bottom 1.016: v5.86,21.4 v5.87,21.4 6.67,22.2 12.86,22.2
  other vias: 6.31,21.6 11.96,22.2 12.46,22.4
  pour Top (no thermals): 10.45,9.39 9.16,8.1 9.16,6.7 8.53,7.29 8.53,10.26 9.24,10.57 9.9,9.91 11.11,9.91 11.11,9.39
  pour Top (no thermals): 6.37,21.34 6.95,21.93 9.06,21.93 9.06,22.6 6.4,22.6 5.96,22.16 5.96,21.75
  pour Top (no thermals): 13.08,21.82 13.08,21.34 12.03,21.34 12.03,21.63 11.66,22 11.66,22.4 11.96,22.7 13.16,22.7 13.36,22.5 13.36,22.1
  pour Top (no thermals): 19.06,25.9 19.96,25.9 19.96,26.6 19.36,27.2 19.36,27.9 18.56,27.9 18.45,27.79 17.66,27.79 17.66,27.66 17.93,27.66 18.36,27.23 18.36,26.6
VCC_5V0  (via drill 0.25)
  Route2 1.27: J2.3 1.26,28.97 10.56,19.67 10.56,11.08 v10.66,10.98
  other vias: 10.26,10.68 10.26,11.28 11.06,11.28 11.06,10.68
  pour Top (no thermals): 11.26,12.88 10.06,12.88 10.06,10.44 11.36,10.44 11.36,11.98 11.26,12.08
  pour Route2 (no thermals): 10.36,10.22 10.96,10.22 11.26,10.52 11.26,11.37 10.81,11.82 10.46,11.82 9.96,11.32 9.96,10.62
VSYS  (via drill 0.25)
  Top 0.152: 2.76,29.47 U8.10 2.76,30.2 C17.1 2.78,30.84 v2.96,31.02 | v6.59,30.76 6.61,30.74 6.61,30.57 R6.2 | SW2.2 v18.82,18.4 SW2.1 18.76,17.39
  Route2 0.152: v2.96,31.02 3.31,30.67 3.31,29.97 7.31,25.97 7.31,25.92 | v6.59,30.76 6.61,30.74 6.61,27.42 7.31,26.72 v7.41,26.62
  Route2 0.508: v16.94,15.59 v16.39,15.59 12.01,15.59 11.96,15.54
  Route2 1.27: v12.86,11.22 12.86,11.32 11.96,12.22 11.96,15.54 11.96,20.32 7.31,24.97 7.31,25.92 7.31,26.72
  Route15 0.152: v18.82,18.4 18.82,17.47 v16.94,15.59
  Bottom 0.152: v2.96,31.02 3.58,31.64 3.58,33.32 3.83,33.57 4.19,33.57 4.44,33.32 4.44,33.12 4.76,32.8 5.38,32.8 JMP2.P$1
  other vias: 12.36,11.22 12.76,10.72 13.36,11.42 12.26,10.72 6.91,25.17 7.31,25.47 7.71,25.17 6.91,25.77 7.31,26.07 7.71,25.77 7.81,26.27 13.26,10.92 7.31,24.82
  pour Top (no thermals): 13.64,14.4 13.64,10.52 11.96,10.52 11.96,14.22 12.14,14.4
  pour Top (no thermals): 6.71,26.62 6.71,24.72 7.71,23.72 9.06,23.72 9.06,24.62 8.26,24.62 8.06,24.82 8.01,24.92 8.01,26.47 7.56,26.92 7.01,26.92
  pour Top (no thermals): 16.06,15.17 16.06,14.57 16.71,14.57
  pour Route2 (no thermals): 11.98,11.6 11.98,10.7 12.18,10.5 13.28,10.5 13.58,10.8 13.58,11.5 12.53,12.55 12.38,12.4 12.38,12
  pour Top (no thermals): 13.64,14.9 13.64,14.31 12.59,14.31 12.59,14.33 13.16,14.9
  pour Top (no thermals): 16.87,15.21 16.87,14.54 16.39,14.54 16.36,14.57 16.36,14.86 15.96,15.26 15.4,15.26 15.39,15.27 15.39,15.88 16.98,15.88 17.1,15.76 17.1,15.44

## Text on the board
Bottom: V1
bPlace: Designed By | Z | X | Y
Document: nRF9160 Thing Plus | Notes: / / * T4 solder paste / * Lead Free assembly / * Measures in inches | Sparkfun
tDocu: TOP
bDocu: BOT | (Top down)